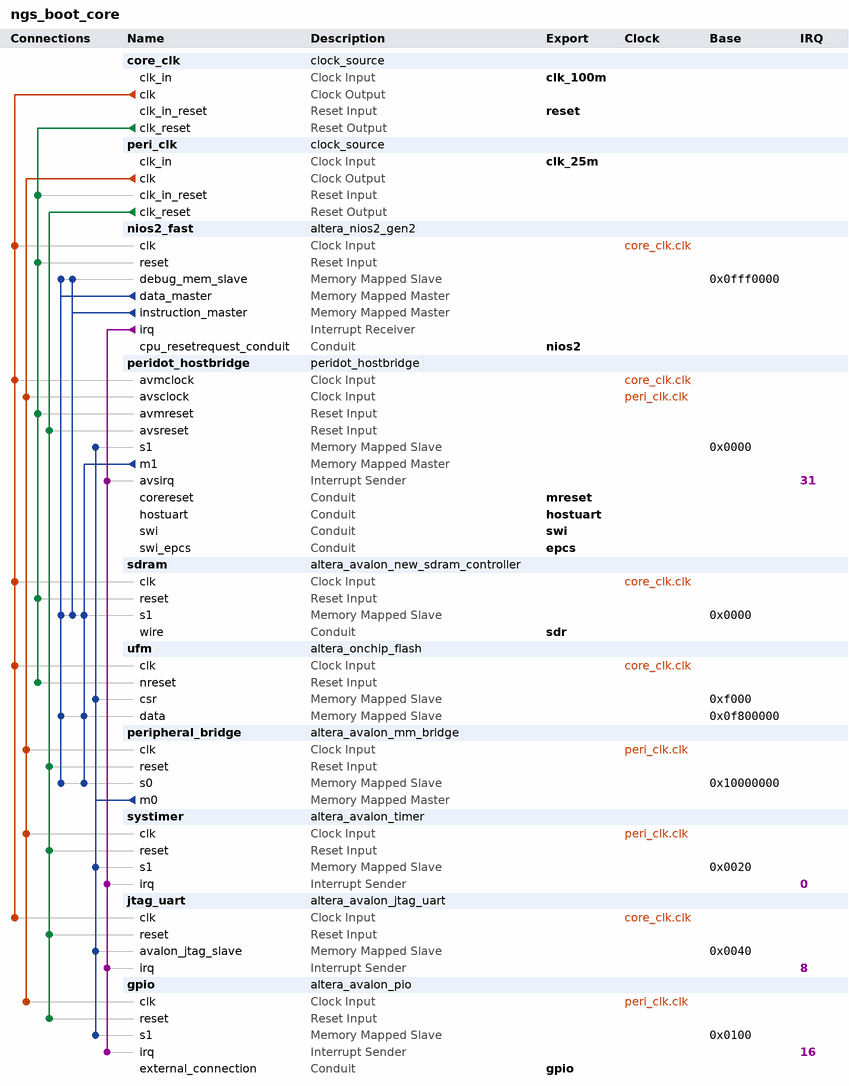
[diagram p0: system contents]
# Platform Designer (Qsys) system ngs_boot_core, MAX 10 10M08SAE144C8G
# Parameters at their usual value, and those the tool derives, are not listed.
package require -exact qsys 16.1
create_system ngs_boot_core
set_project_property DEVICE_FAMILY {MAX 10}
set_project_property DEVICE 10M08SAE144C8G

add_instance core_clk clock_source 16.1
set_instance_parameter_value core_clk clockFrequency 100000000

add_instance peri_clk clock_source 16.1
set_instance_parameter_value peri_clk clockFrequency 25000000

add_instance nios2_fast altera_nios2_gen2 16.1
set_instance_parameter_value nios2_fast cpuReset true
set_instance_parameter_value nios2_fast dcache_size 8192
set_instance_parameter_value nios2_fast dividerType srt2
set_instance_parameter_value nios2_fast exceptionSlave sdram.s1
set_instance_parameter_value nios2_fast icache_size 16384
set_instance_parameter_value nios2_fast impl Fast
set_instance_parameter_value nios2_fast mul_64_impl 1
set_instance_parameter_value nios2_fast resetSlave sdram.s1
set_instance_parameter_value nios2_fast setting_branchpredictiontype Static
set_instance_parameter_value nios2_fast setting_shadowRegisterSets 7
set_instance_parameter_value nios2_fast shift_rot_impl 0

add_instance peridot_hostbridge peridot_hostbridge 16.1
set_instance_parameter_value peridot_hostbridge AVM_CLOCKFREQ 100000000
set_instance_parameter_value peridot_hostbridge AVS_CLOCKFREQ 25000000
set_instance_parameter_value peridot_hostbridge HOSTINTERFACE_TYPE UART
set_instance_parameter_value peridot_hostbridge HOSTUART_BAUDRATE 115200
set_instance_parameter_value peridot_hostbridge HOSTUART_INFIFODEPTH 6
set_instance_parameter_value peridot_hostbridge PART_NAME 10M08SAE144C8G
set_instance_parameter_value peridot_hostbridge PERIDOT_GENCODE 88
set_instance_parameter_value peridot_hostbridge RECONF_DELAY_TIME 200
set_instance_parameter_value peridot_hostbridge SWI_CLASSID 1923678208
set_instance_parameter_value peridot_hostbridge SWI_CPURESET_INIT 1
set_instance_parameter_value peridot_hostbridge SWI_CPURESET_KEY 57005
set_instance_parameter_value peridot_hostbridge SWI_TIMECODE 0
set_instance_parameter_value peridot_hostbridge SWI_USE_EPCSBOOT true
set_instance_parameter_value peridot_hostbridge SWI_USE_MESSAGE true
set_instance_parameter_value peridot_hostbridge SWI_USE_UIDREAD true
set_instance_parameter_value peridot_hostbridge USE_ALTDUALBOOT true
set_instance_parameter_value peridot_hostbridge USE_CHIPUID true
set_instance_parameter_value peridot_hostbridge USE_RECONFIG false

add_instance sdram altera_avalon_new_sdram_controller 16.1
set_instance_parameter_value sdram TAC 6.0
set_instance_parameter_value sdram TRCD 21.0
set_instance_parameter_value sdram TRFC 63.0
set_instance_parameter_value sdram TRP 21.0
set_instance_parameter_value sdram casLatency 2
set_instance_parameter_value sdram columnWidth 8
set_instance_parameter_value sdram dataWidth 16
set_instance_parameter_value sdram generateSimulationModel false
set_instance_parameter_value sdram model single_Micron_MT48LC4M32B2_7_chip
set_instance_parameter_value sdram numberOfBanks 4
set_instance_parameter_value sdram numberOfChipSelects 1
set_instance_parameter_value sdram powerUpDelay 200.0
set_instance_parameter_value sdram refreshPeriod 15.625
set_instance_parameter_value sdram rowWidth 12

add_instance ufm altera_onchip_flash 16.1
set_instance_parameter_value ufm CONFIGURATION_MODE {Dual Compressed Images}
set_instance_parameter_value ufm READ_BURST_COUNT 2
set_instance_parameter_value ufm SECTOR_ACCESS_MODE {Read and write,Read and write,Read and write,Read and write,Hidden}
set_instance_parameter_value ufm initFlashContent false
set_instance_parameter_value ufm initializationFileName altera_onchip_flash.hex
set_instance_parameter_value ufm useNonDefaultInitFile false

add_instance peripheral_bridge altera_avalon_mm_bridge 16.1
set_instance_parameter_value peripheral_bridge ADDRESS_UNITS SYMBOLS
set_instance_parameter_value peripheral_bridge ADDRESS_WIDTH 10
set_instance_parameter_value peripheral_bridge DATA_WIDTH 32
set_instance_parameter_value peripheral_bridge MAX_PENDING_RESPONSES 1
set_instance_parameter_value peripheral_bridge USE_AUTO_ADDRESS_WIDTH 1

add_instance systimer altera_avalon_timer 16.1
set_instance_parameter_value systimer period 1
set_instance_parameter_value systimer periodUnits MSEC

add_instance jtag_uart altera_avalon_jtag_uart 16.1
set_instance_parameter_value jtag_uart simInteractiveOptions NO_INTERACTIVE_WINDOWS

add_instance gpio altera_avalon_pio 16.1
set_instance_parameter_value gpio bitModifyingOutReg true
set_instance_parameter_value gpio direction Bidir
set_instance_parameter_value gpio edgeType ANY
set_instance_parameter_value gpio generateIRQ true
set_instance_parameter_value gpio width 30

# connections
add_connection core_clk.clk jtag_uart.clk clock
add_connection core_clk.clk nios2_fast.clk clock
add_connection core_clk.clk peridot_hostbridge.avmclock clock
add_connection core_clk.clk sdram.clk clock
add_connection core_clk.clk ufm.clk clock
add_connection peri_clk.clk gpio.clk clock
add_connection peri_clk.clk peridot_hostbridge.avsclock clock
add_connection peri_clk.clk peripheral_bridge.clk clock
add_connection peri_clk.clk systimer.clk clock
add_connection core_clk.clk_reset nios2_fast.reset reset
add_connection core_clk.clk_reset peri_clk.clk_in_reset reset
add_connection core_clk.clk_reset peridot_hostbridge.avmreset reset
add_connection core_clk.clk_reset sdram.reset reset
add_connection core_clk.clk_reset ufm.nreset reset
add_connection peri_clk.clk_reset gpio.reset reset
add_connection peri_clk.clk_reset jtag_uart.reset reset
add_connection peri_clk.clk_reset peridot_hostbridge.avsreset reset
add_connection peri_clk.clk_reset peripheral_bridge.reset reset
add_connection peri_clk.clk_reset systimer.reset reset
add_connection nios2_fast.data_master nios2_fast.debug_mem_slave avalon
set_connection_parameter_value nios2_fast.data_master/nios2_fast.debug_mem_slave baseAddress 0x0fff0000
add_connection nios2_fast.data_master peripheral_bridge.s0 avalon
set_connection_parameter_value nios2_fast.data_master/peripheral_bridge.s0 baseAddress 0x10000000
add_connection nios2_fast.data_master sdram.s1 avalon
set_connection_parameter_value nios2_fast.data_master/sdram.s1 baseAddress 0x0000
add_connection nios2_fast.data_master ufm.data avalon
set_connection_parameter_value nios2_fast.data_master/ufm.data baseAddress 0x0f800000
add_connection nios2_fast.instruction_master nios2_fast.debug_mem_slave avalon
set_connection_parameter_value nios2_fast.instruction_master/nios2_fast.debug_mem_slave baseAddress 0x0fff0000
add_connection nios2_fast.instruction_master sdram.s1 avalon
set_connection_parameter_value nios2_fast.instruction_master/sdram.s1 baseAddress 0x0000
add_connection peridot_hostbridge.m1 peripheral_bridge.s0 avalon
set_connection_parameter_value peridot_hostbridge.m1/peripheral_bridge.s0 baseAddress 0x10000000
add_connection peridot_hostbridge.m1 sdram.s1 avalon
set_connection_parameter_value peridot_hostbridge.m1/sdram.s1 baseAddress 0x0000
add_connection peridot_hostbridge.m1 ufm.data avalon
set_connection_parameter_value peridot_hostbridge.m1/ufm.data baseAddress 0x0f800000
add_connection peripheral_bridge.m0 gpio.s1 avalon
set_connection_parameter_value peripheral_bridge.m0/gpio.s1 baseAddress 0x0100
add_connection peripheral_bridge.m0 jtag_uart.avalon_jtag_slave avalon
set_connection_parameter_value peripheral_bridge.m0/jtag_uart.avalon_jtag_slave baseAddress 0x0040
add_connection peripheral_bridge.m0 peridot_hostbridge.s1 avalon
set_connection_parameter_value peripheral_bridge.m0/peridot_hostbridge.s1 baseAddress 0x0000
add_connection peripheral_bridge.m0 systimer.s1 avalon
set_connection_parameter_value peripheral_bridge.m0/systimer.s1 baseAddress 0x0020
add_connection peripheral_bridge.m0 ufm.csr avalon
set_connection_parameter_value peripheral_bridge.m0/ufm.csr baseAddress 0xf000
add_connection nios2_fast.irq gpio.irq interrupt
set_connection_parameter_value nios2_fast.irq/gpio.irq irqNumber 16
add_connection nios2_fast.irq jtag_uart.irq interrupt
set_connection_parameter_value nios2_fast.irq/jtag_uart.irq irqNumber 8
add_connection nios2_fast.irq peridot_hostbridge.avsirq interrupt
set_connection_parameter_value nios2_fast.irq/peridot_hostbridge.avsirq irqNumber 31
add_connection nios2_fast.irq systimer.irq interrupt
set_connection_parameter_value nios2_fast.irq/systimer.irq irqNumber 0

# exported interfaces
add_interface clk_100m clock sink
set_interface_property clk_100m EXPORT_OF core_clk.clk_in
add_interface clk_25m clock sink
set_interface_property clk_25m EXPORT_OF peri_clk.clk_in
add_interface epcs conduit end
set_interface_property epcs EXPORT_OF peridot_hostbridge.swi_epcs
add_interface gpio conduit end
set_interface_property gpio EXPORT_OF gpio.external_connection
add_interface hostuart conduit end
set_interface_property hostuart EXPORT_OF peridot_hostbridge.hostuart
add_interface mreset conduit end
set_interface_property mreset EXPORT_OF peridot_hostbridge.corereset
add_interface nios2 conduit end
set_interface_property nios2 EXPORT_OF nios2_fast.cpu_resetrequest_conduit
add_interface reset reset sink
set_interface_property reset EXPORT_OF core_clk.clk_in_reset
add_interface sdr conduit end
set_interface_property sdr EXPORT_OF sdram.wire
add_interface swi conduit end
set_interface_property swi EXPORT_OF peridot_hostbridge.swi

set_interconnect_requirement {$system} qsys_mm.clockCrossingAdapter HANDSHAKE
set_interconnect_requirement {$system} qsys_mm.enableEccProtection FALSE
set_interconnect_requirement {$system} qsys_mm.insertDefaultSlave FALSE
set_interconnect_requirement {$system} qsys_mm.maxAdditionalLatency 1
set_interconnect_requirement {mm_interconnect_1|cmd_mux_002} qsys_mm.postTransform.pipelineCount 0
set_interconnect_requirement {mm_interconnect_1|cmd_mux_003} qsys_mm.postTransform.pipelineCount 0
set_interconnect_requirement {mm_interconnect_1|cmd_mux_004} qsys_mm.postTransform.pipelineCount 0

save_system ngs_boot_core.qsys
